# EAGLE design untitled (EAGLE 9.6.2)
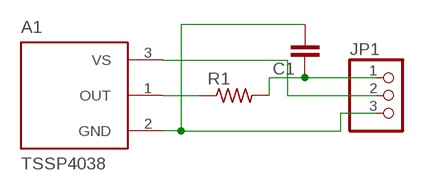
[diagram p0: schematic, sheet 1]

## Parts
A1  TSSP4038  [XDCR_TSSP4038]
C1  C-EUC0402  [C0402]
JP1  PINHD-1X3/90  [1X03/90]
R1  R-US_R0402  [R0402]

## Nets
N$1: A1.1(OUT) R1.1
N$2: C1.1 JP1.1 R1.2
N$3: A1.2(GND) C1.2 JP1.3
N$4: A1.3(VS) JP1.2

## Library data of the parts
A1 = TSSP4038:TSSP4038: Check availability <https://pricing.snapeda.com/parts/TSSP4038/Vishay%20Semiconductor/view-part?ref=eda>; AVAILABILITY: In Stock; DESCRIPTION: Remote Receiver Sensor, 38.0kHz 1m PCB, Through Hole; MF: Vishay Semiconductor; MP: TSSP4038; PACKAGE: None; PRICE: None; PURCHASE-URL: https://pricing.snapeda.com/search/part/TSSP4038/?ref=eda
C1 = rcl:C-EU: CAPACITOR, European symbol; SPICEPREFIX: C
JP1 = pinhead:PINHD-1X3: PIN HEADER
R1 = rcl:R-US_: RESISTOR, American symbol; SPICEPREFIX: R

## Board
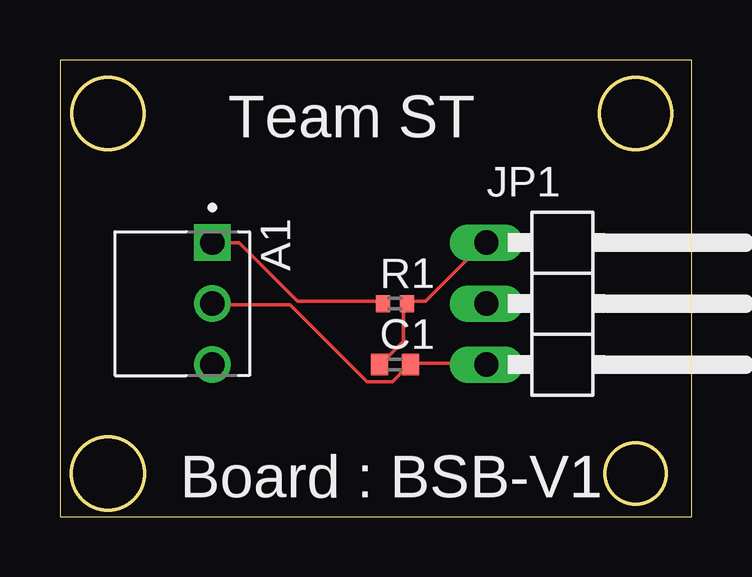
[diagram p1: board, top side]
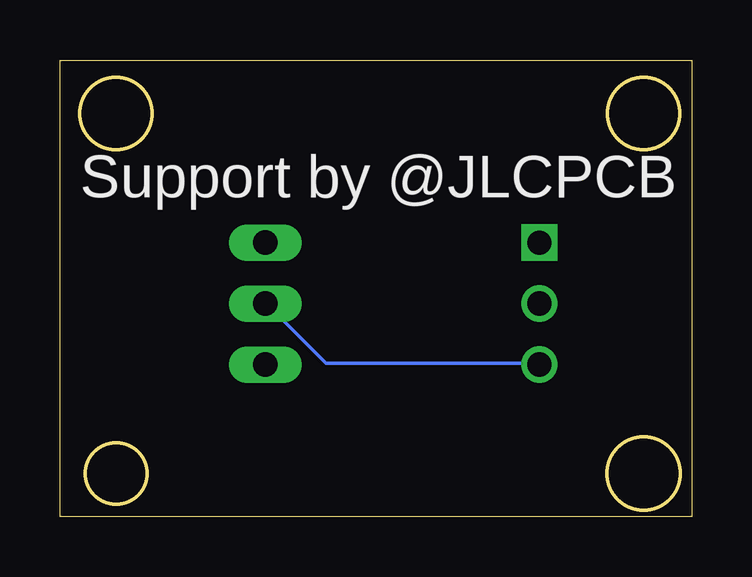
[diagram p2: board, bottom side, seen from below]

Size 26.34 x 19.04 mm. Coordinates in mm from the lower left corner, seen from the top.
Outline: 0,0 26.34,0 26.34,19.04 0,19.04 0,0
Outline: circle at 2,16.81 radius 1.5
Outline: circle at 24,16.81 radius 1.5
Outline: circle at 24,1.81 radius 1.27
Outline: circle at 2,1.81 radius 1.52
Copper layers (1*16): Top 0.035mm / dielectric 1.5mm / Bottom 0.035mm
Design rules "default": minimum track width 6mil, minimum drill 0.35mm, track to track 6mil, track to pad 6mil, pad to pad 6mil, via to via 6mil, smd to smd 6mil, copper to edge 40mil, drill to drill 6mil, minimum pad ring 10mil, minimum via ring 8mil, stop-mask expansion 4mil, vias tented up to drill 0mil, thermal gap 10mil

### Footprints (pad centres in the part's own frame; a part is rotated, then mirrored left to right if it is on the bottom)
XDCR_TSSP4038 = drill 1.01 square: 1 -2.54,0 | drill 1.01: 2 0,0; 3 2.54,0
C0402 = smd 0.7 x 0.9: 1 -0.65,0; 2 0.65,0
1X03/90 = drill 1.016 long: 1 -2.54,-3.81; 2 0,-3.81; 3 2.54,-3.81
R0402 = smd 0.6 x 0.7: 1 -0.5,0; 2 0.5,0

### Placement (x,y rotation side)
A1  6.35,8.89 270 top
C1  13.97,6.35 0 top
JP1  21.59,8.89 270 top
R1  13.97,8.89 0 top

### Tracks (layer width: path | path; a pad name or v marks a point on that pad's centre or on a via)
N$1
  Top 0.152: A1.1 7.47,11.43 9.91,8.99 13.41,8.99 R1.1
N$2
  Top 0.152: C1.1 13.41,6.4 14.33,7.31 14.33,8.84 R1.2 14.48,8.99 15.24,8.99 17.68,11.43 JP1.1
N$3
  Top 0.152: JP1.3 17.68,6.4 14.63,6.4 C1.2 14.48,6.25 13.87,5.64 12.8,5.64 9.6,8.84 6.4,8.84 A1.2
N$4
  Bottom 0.152: A1.3 6.4,6.4 15.24,6.4 17.68,8.84 JP1.2

### Text on the board
tNames: Team ST | Board : BSB-V1
bNames: Support by @JLCPCB